# EAGLE design AQS-v4_0 (EAGLE 9.7.0)
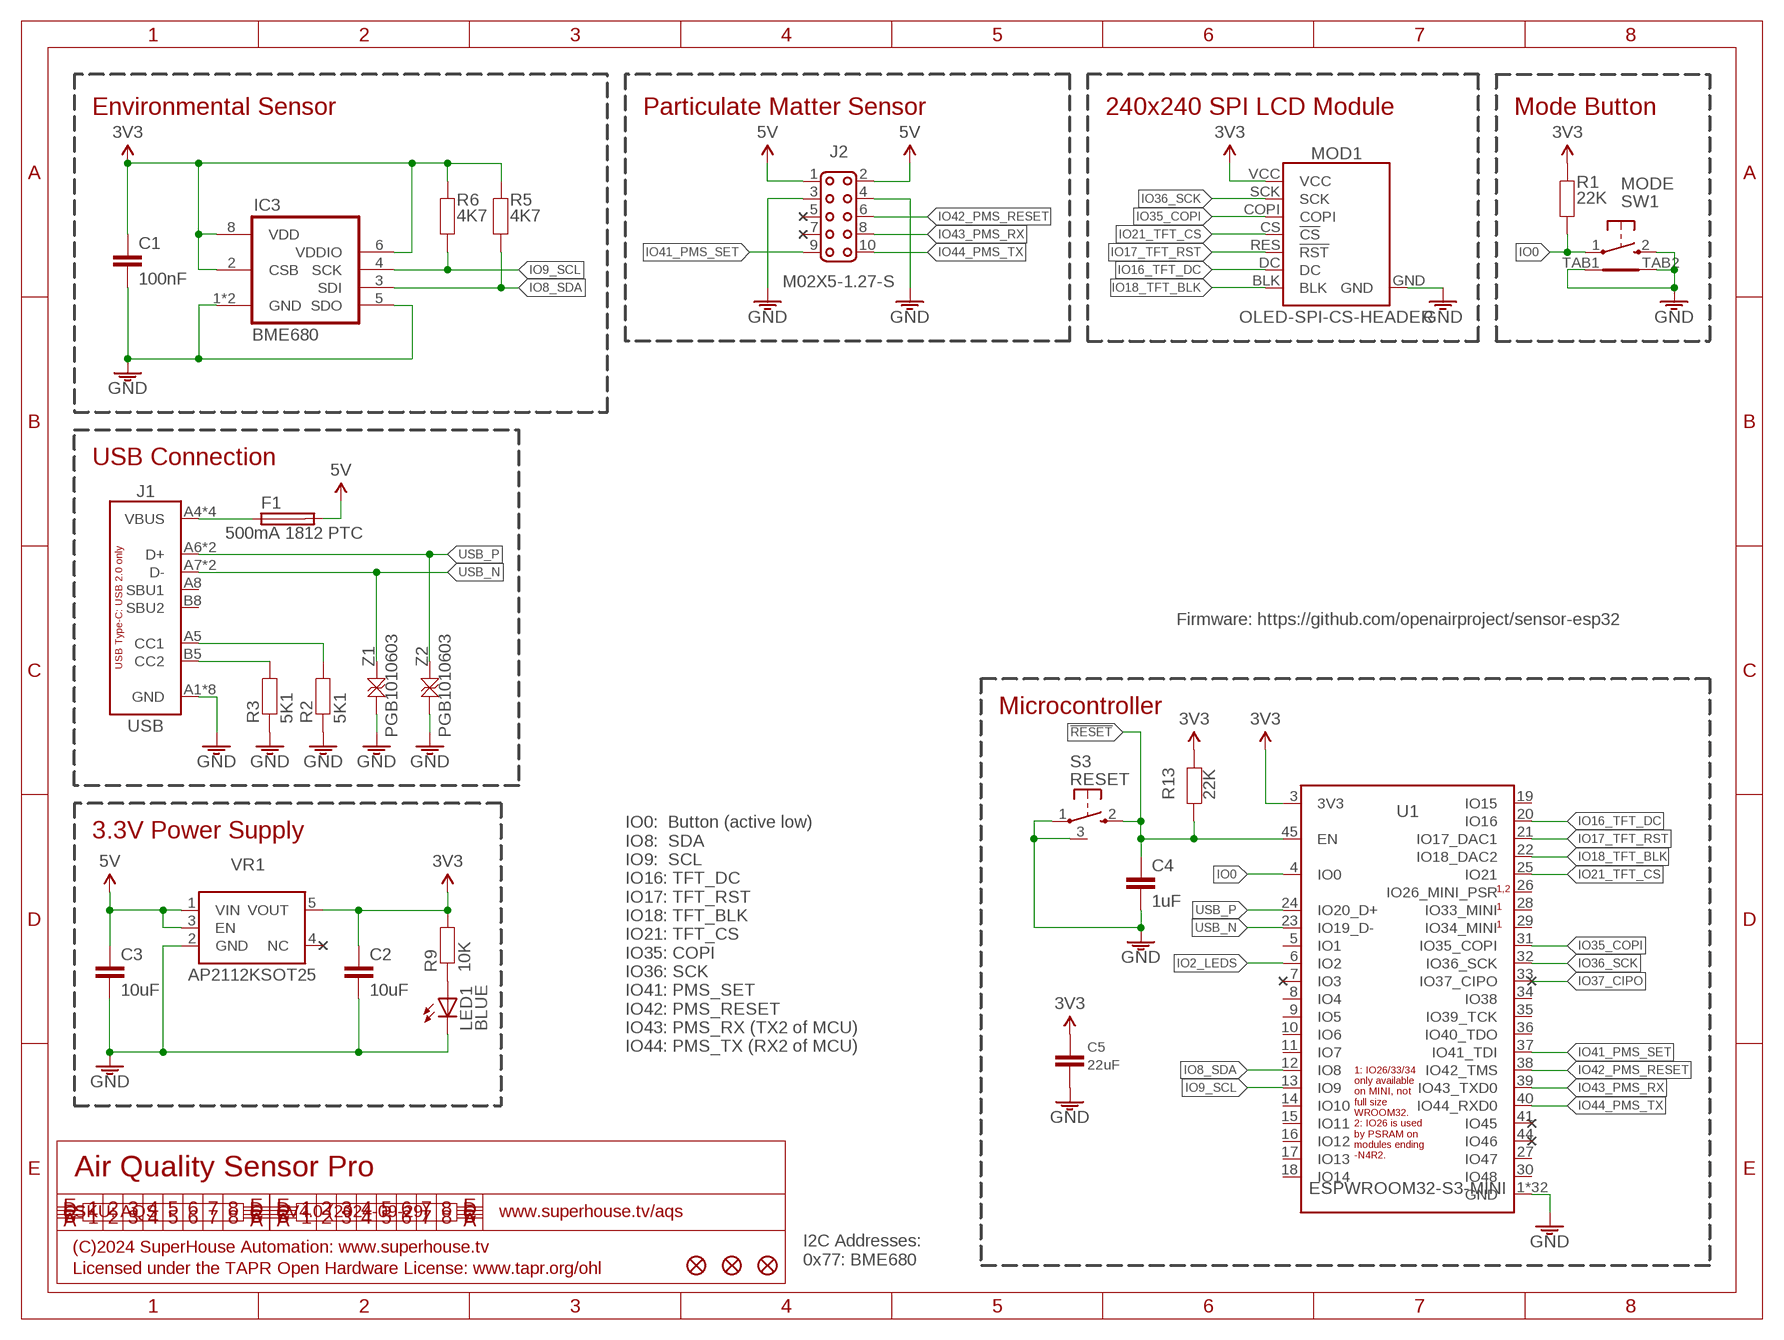
[diagram p0: schematic, sheet 1]

## Parts
C1  100nF  CAP0603  [C0603]
C2  10uF  CAP0805  [C0805]
C3  10uF  CAP0805  [C0805]
C4  1uF  CAP0603  [C0603]
C5  22uF  CAP0805  [C0805]
F1  500mA 1812 PTC  PTC-1206  [1206]
IC3  BME680  [BME680]
J1  USB  USB-C-16P-16P-VERT  [USB-C-VERT]
J2  M02X5-1.27-S  [2X05-1.27-S]
LED1  BLUE  LED0603  [LED-0603]
MOD1  OLED-SPI-CS-HEADER  [OLED-240X240-1.54-HEADER]
R1  22K  RESISTOR0603  [R0603]
R2  5K1  RESISTOR0603  [R0603]
R3  5K1  RESISTOR0603  [R0603]
R5  4K7  RESISTOR0603  [R0603]
R6  4K7  RESISTOR0603  [R0603]
R9  10K  RESISTOR0603  [R0603]
R13  22K  RESISTOR0603  [R0603]
S3  RESET  TAC-SWITCH-1TABGT-TCB73B  [TACT-VERT-1TAB]
SW1  MODE  TAC-SWITCH-2PIN-GND-FSMRAJ  [TYCO-FSMRAJ]
U1  ESPWROOM32-S3-MINI  [ESP32-S3-MINI]
U$23  FIDUCIAL1X2  [FIDUCIAL-1X2]
U$24  FIDUCIAL1X2  [FIDUCIAL-1X2]
U$25  FIDUCIAL1X2  [FIDUCIAL-1X2]
VR1  AP2112KSOT25  [SOT23-5]
Z1  PGB1010603  TVS0603  [TVS0603]
Z2  PGB1010603  TVS0603  [TVS0603]

## Nets
3.3V: C1.1 C2.1 C5.1 IC3.2(CSB) IC3.6(VDDIO) IC3.8(VDD) MOD1.VCC R1.2 R5.2 R6.2 R9.2 R13.1 U1.3(3V3) VR1.5(VOUT)
5V: C3.1 F1.2 J2.1 J2.2 VR1.1(VIN) VR1.3(EN)
!RESET: C4.1 R13.2 S3.2 U1.45(EN)
GND: C1.2 C2.2 C3.2 C4.2 C5.2 IC3.1(GND) IC3.5(SDO) IC3.7(GND) J1.A1(GND) J1.A12(GND) J1.B1(GND) J1.B12(GND) J1.FIX1(GND) J1.FIX2(GND) J1.FIX3(GND) J1.FIX4(GND) J2.3 J2.4 LED1.C MOD1.GND R2.1 R3.1 S3.1 S3.3 SW1.2 SW1.TAB1 SW1.TAB2 U1.1(GND) U1.2(GND) U1.42(GND) U1.43(GND) U1.46(GND) U1.47(GND) U1.48(GND) U1.49(GND) U1.50(GND) U1.51(GND) U1.52(GND) U1.53(GND) U1.54(GND) U1.55(GND) U1.56(GND) U1.57(GND) U1.58(GND) U1.59(GND) U1.60(GND) U1.61(GND) U1.62(GND) U1.63(GND) U1.64(GND) U1.65(GND) U1.G1(GND) U1.G2(GND) U1.G3(GND) U1.G4(GND) U1.G6(GND) U1.G7(GND) U1.G8(GND) U1.G9(GND) VR1.2(GND) Z1.1 Z2.1
IO0: R1.1 SW1.1 U1.4(IO0)
IO2_LEDS: U1.6(IO2)
IO8_SDA: IC3.3(SDI) R5.1 U1.12(IO8)
IO9_SCL: IC3.4(SCK) R6.1 U1.13(IO9)
IO16_TFT_DC: MOD1.DC U1.20(IO16)
IO17_TFT_RST: MOD1.RES(!RST) U1.21(IO17_DAC1)
IO18_TFT_BLK: MOD1.BLK U1.22(IO18_DAC2)
IO21_TFT_CS: MOD1.CS(!CS) U1.25(IO21)
IO35_COPI: MOD1.COPI U1.31(IO35_COPI)
IO36_SCK: MOD1.SCK U1.32(IO36_SCK)
IO37_CIPO: U1.33(IO37_CIPO)
IO41_PMS_SET: J2.9 U1.37(IO41_TDI)
IO42_PMS_RESET: J2.6 U1.38(IO42_TMS)
IO43_PMS_RX: J2.8 U1.39(IO43_TXD0)
IO44_PMS_TX: J2.10 U1.40(IO44_RXD0)
N$1: LED1.A R9.1
N$6: F1.1 J1.A4(VBUS) J1.A9(VBUS) J1.B4(VBUS) J1.B9(VBUS)
N$10: J1.B5(CC2) R3.2
N$11: J1.A5(CC1) R2.2
USB_N: J1.A7(D-) J1.B7(D-) U1.23(IO19_D-) Z1.2
USB_P: J1.A6(D+) J1.B6(D+) U1.24(IO20_D+) Z2.2
Unconnected: J1.A8(SBU1) J1.B8(SBU2) J2.5 J2.7 U1.5(IO1) U1.7(IO3) U1.8(IO4) U1.9(IO5) U1.10(IO6) U1.11(IO7) U1.14(IO10) U1.15(IO11) U1.16(IO12) U1.17(IO13) U1.18(IO14) U1.19(IO15) U1.26(IO26_MINI_PSR) U1.27(IO47) U1.28(IO33_MINI) U1.29(IO34_MINI) U1.30(IO48) U1.34(IO38) U1.35(IO39_TCK) U1.36(IO40_TDO) U1.41(IO45) VR1.4(NC)

## Notes on the sheet
- Environmental Sensor | Particulate Matter Sensor | 240x240 SPI LCD Module | Mode Button
- USB Connection
- Firmware: https://github.com/openairproject/sensor-esp32
- Microcontroller
- 3.3V Power Supply
- IO0:  Button (active low)
  IO8:  SDA
  IO9:  SCL
  IO16: TFT_DC
  IO17: TFT_RST
  IO18: TFT_BLK
  IO21: TFT_CS
  IO35: COPI
  IO36: SCK
  IO41: PMS_SET
  IO42: PMS_RESET
  IO43: PMS_RX (TX2 of MCU)
  IO44: PMS_TX (RX2 of MCU)
- Air Quality Sensor Pro
- SKU: AQS | V4.0 (2024-09-29) | www.superhouse.tv/aqs
- (C)2024 SuperHouse Automation: www.superhouse.tv
- I2C Addresses:
  0x77: BME680
- Licensed under the TAPR Open Hardware License: www.tapr.org/ohl

## Power pins joined to a net without a drawn wire
IO46: U1.44(IO46)

## Library data of the parts
C1-C5 = SuperHouse-DiscreteSemi:CAP: Capacitor Standard ceramic capacitor
F1 = SuperHouse-Fuses:PTC: Resettable polyfuses
IC3 = SuperHouse-Sensors:BME680: BME680 humdity, pressure, temperature, and gas sensor
J1 = SuperHouse-Connectors:USB-C-16P: USB-C socket with 16 pins, suitable only for backward compatibility with USB 2
J2 = SuperHouse-Connectors:M02X5: M10 header in 2x5 format
LED1 = SuperHouse-LEDs:LED: LEDs in various sizes including 5mm and 3mm PTH, and 0402, 0603, 0805, etc SMT
MOD1 = SuperHouse-Displays:OLED-SPI-CS
R1-R3 R5 R6 R9 R13 = SuperHouse-DiscreteSemi:RESISTOR: Resistor Standard resistors.
S3 = SuperHouse-Switches:TAC-SWITCH-1TAB
SW1 = SuperHouse-Switches:TAC-SWITCH-2PIN-GND: Tactile switch (right angle) with 2 mounting tabs
U1 = SuperHouse-MCUs:ESPWROOM32-S3
U$23-U$25 = SuperHouse-Symbols:FIDUCIAL: Fiducial Alignment Points Various fiducial points for machine vision alignment.
VR1 = SuperHouse-Regulators:AP2112K: AP2112K LDO linear voltage regulator
Z1 Z2 = SuperHouse-DiscreteSemi:TVS: TVS voltage protection Zener

## Net classes
0 default: width 0.203 mm, drill 0.356 mm, clearance 0.152 mm
1 power: width 0.203 mm, clearance 0.152 mm

## Board
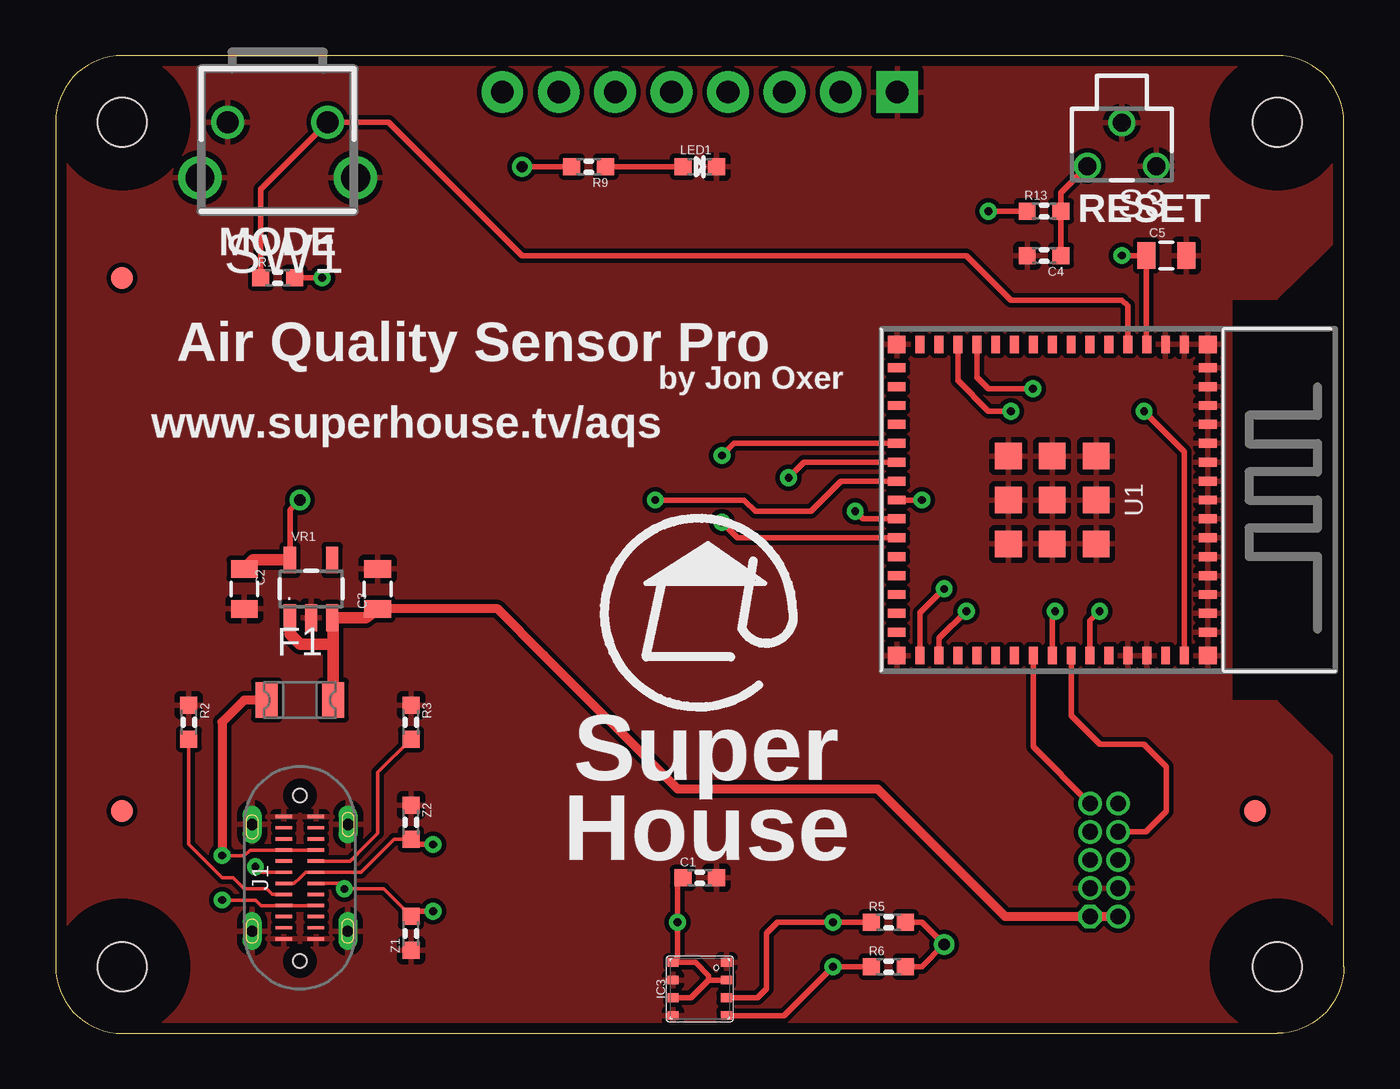
[diagram p1: board, top side]
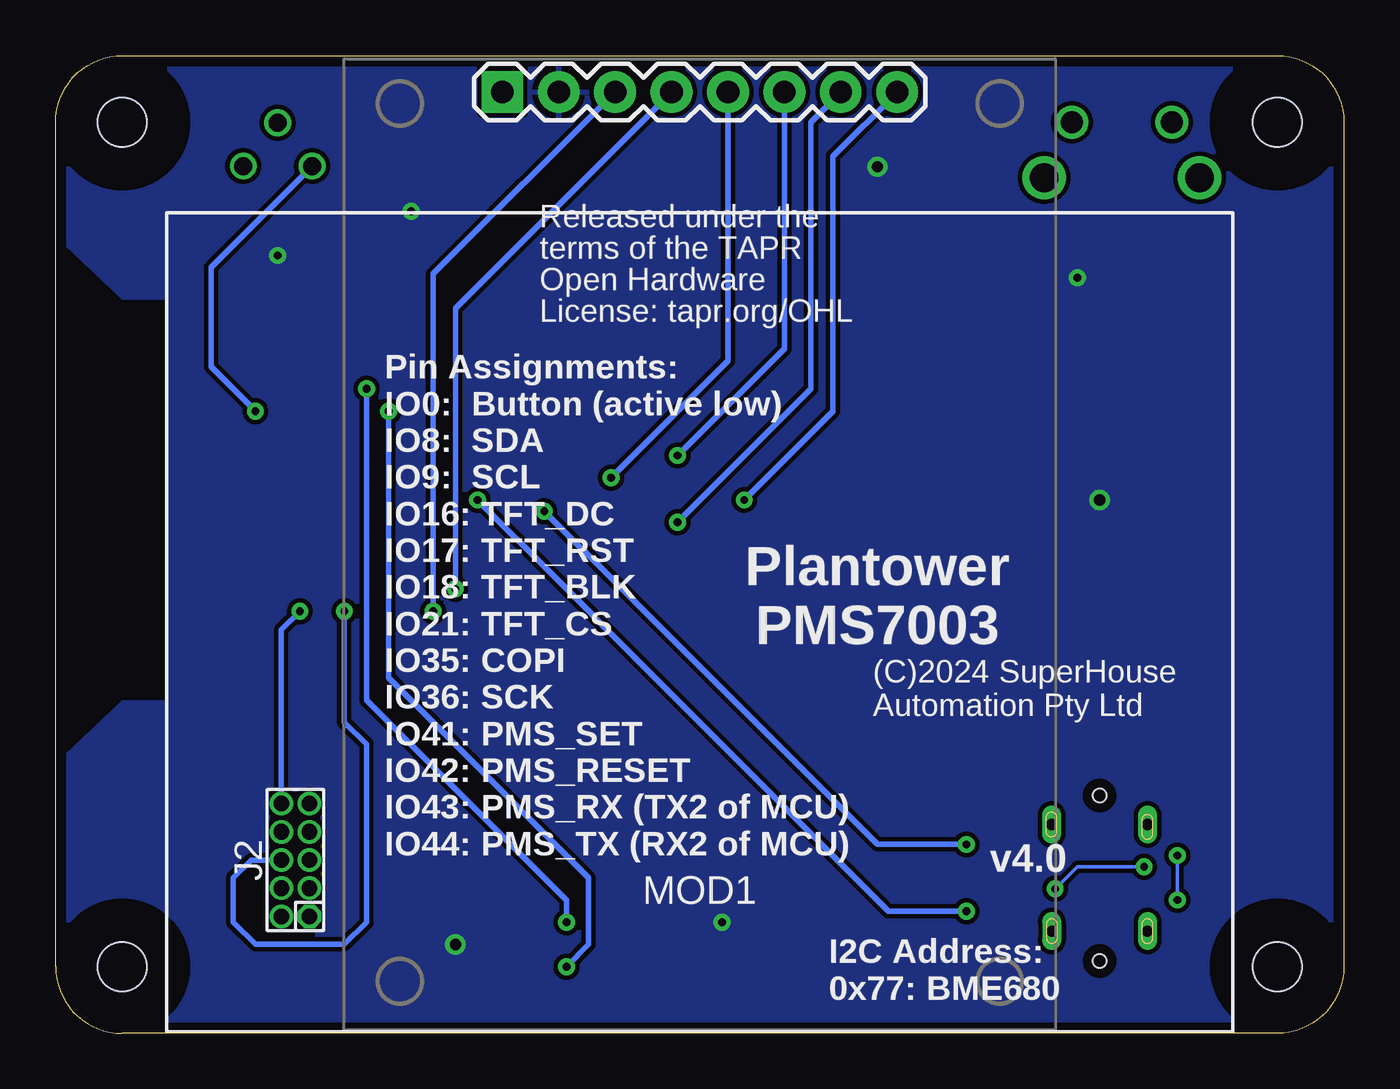
[diagram p2: board, bottom side, seen from below]

Size 58 x 44 mm. Coordinates in mm from the lower left corner, seen from the top.
Outline: 0,41 0,3 arc90 3,0 55,0 arc90 58,3 58,41 arc90 55,44 3,44 arc90 0,41
Copper layers (1*16): Top 0.035mm / dielectric 1.5mm / Bottom 0.035mm
Design rules "SuperHouse-Design-Rules *": minimum track width 10mil, minimum drill 24mil, track to track 8mil, track to pad 8mil, pad to pad 8mil, via to via 8mil, smd to smd 6mil, copper to edge 18mil, drill to drill 8mil, minimum pad ring 7mil, minimum via ring 8mil, stop-mask expansion 4mil, vias tented up to drill 0.5mm, thermal gap 10mil
Holes 2.2 mm at 3,41 55,41 3,3 55,3
tRestrict: area 0,38 to 6,44; area 52,38 to 58,44; area 0,0 to 6,6; area 52,0 to 58,6
bRestrict: area 0,38 to 6,44; area 52,38 to 58,44; area 0,0 to 6,6; area 52,0 to 58,6

### Footprints (pad centres in the part's own frame; a part is rotated, then mirrored left to right if it is on the bottom)
C0603 = smd 0.762 x 0.762: 1 -0.762,0; 2 0.762,0
C0805 = smd 0.8 x 1.2: 1 -0.9,0; 2 0.9,0
1206 = smd 1 x 1.6: 1 -1.5,0; 2 1.5,0
BME680 = smd 0.4 x 0.5: 1 1.2,-1.2; 2 0.4,-1.2; 3 -0.4,-1.2; 4 -1.2,-1.2; 5 -1.2,1.2; 6 -0.4,1.2; 7 0.4,1.2; 8 1.2,1.2
USB-C-VERT = smd 0.15 x 0.75: A1 -2.75,0.725; A2 -2.25,0.725; A3 -1.75,0.725; A4 -1.25,0.725; A5 -0.75,0.725; A6 -0.25,0.725; A7 0.25,0.725; A8 0.75,0.725; A9 1.25,0.725; A10 1.75,0.725; A11 2.25,0.725; A12 2.75,0.725; B1 2.75,-0.725; B2 2.25,-0.725; B3 1.75,-0.725; B4 1.25,-0.725; B5 0.75,-0.725; B6 0.25,-0.725; B7 -0.25,-0.725; B8 -0.75,-0.725; B9 -1.25,-0.725; B10 -1.75,-0.725; B11 -2.25,-0.725; B12 -2.75,-0.725 | drill 0.5 pad 0.7 long: FIX1 -2.4,-2.15; FIX2 -2.4,2.15; FIX3 2.4,2.15; FIX4 2.4,-2.17 | hole 0.6: 3.7,0; -3.75,0
2X05-1.27-S = drill 0.7 pad 1.016 octagon: 1 -2.54,-0.635 | drill 0.7 pad 1.016: 2 -2.54,0.635; 3 -1.27,-0.635; 4 -1.27,0.635; 5 0,-0.635; 6 0,0.635; 7 1.27,-0.635; 8 1.27,0.635; 9 2.54,-0.635; 10 2.54,0.635
LED-0603 = smd 0.762 x 0.762: A -0.762,0; C 0.762,0
OLED-240X240-1.54-HEADER = drill 1.016 pad 1.88: BLK 8.89,20.36; COPI -1.27,20.36; CS 6.35,20.36; DC 3.81,20.36; RES 1.27,20.36; SCK -3.81,20.36; VCC -6.35,20.36 | drill 1.016 pad 1.88 square: GND -8.89,20.36
R0603 = smd 0.762 x 0.762: 1 -0.762,0; 2 0.762,0
TACT-VERT-1TAB = drill 0.8: 1 -1.55,0.975; 2 1.55,0.975; 3 0,-0.975
TYCO-FSMRAJ = drill 1: 1 -2.25,0; 2 2.25,0 | drill 1.3: TAB1 -3.5,2.5; TAB2 3.5,2.5
ESP32-S3-MINI = smd 0.8 x 0.4: 1 -7,5.95; 2 -7,5.1; 3 -7,4.25; 4 -7,3.4; 5 -7,2.55; 6 -7,1.7; 7 -7,0.85; 8 -7,0; 9 -7,-0.85; 10 -7,-1.7; 11 -7,-2.55; 12 -7,-3.4; 13 -7,-4.25; 14 -7,-5.1; 15 -7,-5.95; 31 7,-5.95; 32 7,-5.1; 33 7,-4.25; 34 7,-3.4; 35 7,-2.55; 36 7,-1.7; 37 7,-0.85; 38 7,0; 39 7,0.85; 40 7,1.7; 41 7,2.55; 42 7,3.4; 43 7,4.25; 44 7,5.1; 45 7,5.95 | smd 0.4 x 0.8: 16 -5.95,-7; 17 -5.1,-7; 18 -4.25,-7; 19 -3.4,-7; 20 -2.55,-7; 21 -1.7,-7; 22 -0.85,-7; 23 0,-7; 24 0.85,-7; 25 1.7,-7; 26 2.55,-7; 27 3.4,-7; 28 4.25,-7; 29 5.1,-7; 30 5.95,-7; 46 5.95,7; 47 5.1,7; 48 4.25,7; 49 3.4,7; 50 2.55,7; 51 1.7,7; 52 0.85,7; 53 0,7; 54 -0.85,7; 55 -1.7,7; 56 -2.55,7; 57 -3.4,7; 58 -4.25,7; 59 -5.1,7; 60 -5.95,7 | smd 1.2 x 1.2: 61 0,0; G1 -1.975,1.975; G2 0,1.975; G3 1.975,1.975; G4 -1.975,0; G6 1.975,0; G7 -1.975,-1.975; G8 0,-1.975; G9 1.975,-1.975 | smd 0.8 x 0.8: 62 -7,7; 63 -7,-7; 64 7,-7; 65 7,7
FIDUCIAL-1X2 = smd 1 x 1: 1 0,0
SOT23-5 = smd 0.55 x 1.2: 1 -0.95,-1.3; 2 0,-1.3; 3 0.95,-1.3; 4 0.95,1.3; 5 -0.95,1.3
TVS0603 = smd 0.762 x 0.762: 1 -0.762,0; 2 0.762,0

### Placement (x,y rotation side)
C1  29,7 0 top
C2  8.5,20 270 top
C3  14.5,20 90 top
C4  44.5,35 180 top
C5  50,35 0 top
F1  11,15 0 top
IC3  29,2 90 top
J1  11,7 90 top
J2  47.2,7.8 90 bottom
LED1  29,39 0 top
MOD1  29,22 0 bottom
R1  10,34 0 top
R2  6,14 270 top
R3  16,14 270 top
R5  37.5,5 0 top
R6  37.5,3 0 top
R9  24,39 180 top
R13  44.5,37 0 top
S3  48,40 180 top
SW1  10,41 180 top
U1  44.87,24 270 top
U$23  3,34 0 top
U$24  54,10 0 top
U$25  3,10 0 top
VR1  11.5,20 0 top
Z1  16,4.5 90 top
Z2  16,9.5 270 top

### Tracks (layer width: path | path; a pad name or v marks a point on that pad's centre or on a via)
3.3V  (via drill 0.35, 0.5)
  Top 0.254: IC3.6 28.6,1.6 29.4,2.4 | IC3.2 29.4,2.4 | IC3.8 28.8,3.2 29.4,2.6 29.4,2.4 | R6.2 39,3 v40,4 39,5 R5.2 | v11,24 10.55,23.55 VR1.5 | IC3.8 28,3.4 | v21,39 R9.2 | U1.3 49.1,31.02 C5.1 v48,35 | IC3.8 28,3.4 | 28,3.4 v28,5 28,6.76 C1.1 | R13.1 v42,37 | R1.2 v12,34
  Top 0.508: C2.1 8.9,21.3 VR1.5
  pour Bottom: 58,12 54.95,14.87 52.97,14.87 52.93,14.89 52.89,14.93 52.87,14.97 52.87,33.03 52.89,33.07 52.93,33.11 52.97,33.13 54.95,33.13 58,36 58,41 57.97,41.43 57.88,41.85 57.73,42.25 57.52,42.62 57.27,42.96 56.96,43.27 56.62,43.52 56.25,43.73 55.85,43.88 55.43,43.97 55,44 3,44 2.57,43.97 2.15,43.88 1.75,43.73 1.38,43.52 1.04,43.27 0.73,42.96 0.48,42.62 0.27,42.25 0.12,41.85 0.03,41.43 0,41 0,3 0.03,2.57 0.12,2.15 0.27,1.75 0.48,1.38 0.73,1.04 1.04,0.73 1.38,0.48 1.75,0.27 2.15,0.12 2.57,0.03 3,0 55,0 55.43,0.03 55.85,0.12 56.25,0.27 56.62,0.48 56.96,0.73 57.27,1.04 57.52,1.38 57.73,1.75 57.88,2.15 57.97,2.57 58,3
5V
  Top 0.406: J2.2 J2.1 42.74,5.26 37.9,10.1 37,11 31,11 28,11 22,17 19.9,19.1 C3.1
  Top 0.508: 12.5,17.5 12.5,18.65 VR1.3 13.96,18.7 C3.1 | 12.5,17.5 12,17.5 11,17.5 10.55,17.95 VR1.1 | F1.2 12.5,17.5
!RESET  (via drill 0.35)
  Top 0.254: C4.1 R13.2 45.26,37.84 S3.2 | U1.45 50.82,26.18 v49,28
  Bottom 0.254: v49,28 51,30 51,32 51,34.48 S3.2
GND
  pour Top: 58,12 54.98,14.95 52.98,14.95 52.95,14.98 52.95,33.02 52.98,33.05 54.98,33.05 58,36 58,41 57.97,41.43 57.88,41.85 57.73,42.25 57.52,42.62 57.27,42.96 56.96,43.27 56.62,43.52 56.25,43.73 55.85,43.88 55.43,43.97 55,44 3,44 2.57,43.97 2.15,43.88 1.75,43.73 1.38,43.52 1.04,43.27 0.73,42.96 0.48,42.62 0.27,42.25 0.12,41.85 0.03,41.43 0,41 0,3 0.03,2.57 0.12,2.15 0.27,1.75 0.48,1.38 0.73,1.04 1.04,0.73 1.38,0.48 1.75,0.27 2.15,0.12 2.57,0.03 3,0 55,0 55.43,0.03 55.85,0.12 56.25,0.27 56.62,0.48 56.96,0.73 57.27,1.04 57.52,1.38 57.73,1.75 57.88,2.15 57.97,2.57 58,3
IO0
  Top 0.254: R1.1 9.24,37.99 SW1.1 15,41 17,39 21,35 41,35 43,33 44,33 48,33 48.27,32.73 U1.4
IO8_SDA  (via drill 0.35)
  Top 0.254: IC3.3 31.6,1.6 32,2 32,4.5 32.5,5 v35,5 R5.1 | U1.12 41.47,29.53 42,29 v44,29
  Bottom 0.254: v44,29 44,19 44,16 44,15 39,10 35,6 v35,5
IO9_SCL  (via drill 0.35)
  Top 0.254: IC3.4 32.8,0.8 33.74,1.74 v35,3 R6.1 | U1.13 40.62,29.38 42,28 v43,28
  Bottom 0.254: v43,28 43,25 43,16 41,14 34,7 34,6 34,4 v35,3
IO16_TFT_DC  (via drill 0.35)
  Top 0.254: v30,26 30.55,26.55 U1.20
  Bottom 0.254: MOD1.DC 25.19,30.81 v30,26
IO17_TFT_RST  (via drill 0.35)
  Top 0.254: v33,25 33.7,25.7 U1.21
  Bottom 0.254: MOD1.RES 27.73,30.27 v33,25
IO18_TFT_BLK  (via drill 0.35)
  Top 0.254: v27,24 31,24 31.5,23.5 32.5,23.5 34,23.5 34.5,24 35.35,24.85 U1.22
  Bottom 0.254: MOD1.BLK 23,39.47 23,38 23,28 v27,24
IO21_TFT_CS  (via drill 0.35)
  Top 0.254: v30,23 30.7,22.3 U1.25
  Bottom 0.254: MOD1.CS 24,41.01 24,30 24,29 v30,23
IO35_COPI  (via drill 0.35)
  Top 0.254: U1.31 38.92,18.92 v40,20
  Bottom 0.254: v40,20 40,32.63 MOD1.COPI
IO36_SCK  (via drill 0.35)
  Top 0.254: U1.32 39.77,17.77 v41,19
  Bottom 0.254: v41,19 41,34 41,34.17 MOD1.SCK
IO41_PMS_SET
  Top 0.254: U1.37 44.02,12.88 J2.9
IO42_PMS_RESET  (via drill 0.35)
  Top 0.254: U1.38 44.87,18.87 v45,19
  Bottom 0.254: v45,19 45,14 44,13 44,5 45,4 49,4 50,5 50,7 49.2,7.8 J2.6
IO43_PMS_RX
  Top 0.254: U1.39 45.72,14.28 47,13 49,13 50,12 50,10 49.07,9.07 J2.8
IO44_PMS_TX  (via drill 0.35)
  Top 0.254: v47,19 46.57,18.57 U1.40
  Bottom 0.254: J2.10 47.84,18.16 v47,19
N$1
  Top 0.254: R9.1 LED1.A
N$6  (via drill 0.35)
  Top 0.152: J1.B4 J1.A9 8.75,8.25 8.5,8 v7.5,8 | J1.B9 J1.A4 9.25,5.75 9,6 v7.5,6
  Top 0.406: F1.1 8.5,15 7.5,14 v7.5,8
  Bottom 0.152: v7.5,6 v7.5,8
N$10
  Top 0.152: J1.B5 13.25,7.75 14,8.5 14.5,9 14.5,10 14.5,11.74 R3.2
N$11
  Top 0.152: J1.A5 9.75,6.25 9.5,6.5 9,6.5 8.5,6.5 8,7 7.5,7 6,8.5 R2.2
USB_N  (via drill 0.35)
  Top 0.152: J1.A7 9.25,7.25 v9,7.5 | J1.B7 12.75,6.75 v13,6.5 14.76,6.5 Z1.2
  Top 0.254: U1.23 v39,24 | v17,5.5 16.24,5.5 Z1.2
  Bottom 0.152: v9,7.5 12,7.5 v13,6.5
  Bottom 0.254: v39,24 35.5,20.5 32,17 20.5,5.5 v17,5.5
USB_P  (via drill 0.35)
  Top 0.152: J1.A6 10.75,6.75 11,7 11.25,7.25 J1.B6 13.75,7.25 14,7.5 15.24,8.74 Z2.2
  Top 0.254: U1.24 36.35,23.15 v36,23.5 | v17,8.5 16.24,8.5 Z2.2
  Bottom 0.254: v36,23.5 32.5,20 21,8.5 v17,8.5

### Text on the board
tPlace: RESET | MODE | Air Quality Sensor Pro | by Jon Oxer | www.superhouse.tv/aqs | Super / House
bPlace: Released under the / terms of the TAPR / Open Hardware / License: tapr.org/OHL | Plantower / PMS7003 | (C)2024 SuperHouse / Automation Pty Ltd | Pin Assignments: / IO0: Button (active low) / IO8: SDA / IO9: SCL / IO16: TFT_DC / IO17: TFT_RST / IO18: TFT_BLK / IO21: TFT_CS / IO35: COPI / IO36: SCK / IO41: PMS_SET / IO42: PMS_RESET / IO43: PMS_RX (TX2 of MCU) / IO44: PMS_TX (RX2 of MCU) | v4.0 | I2C Address: / 0x77: BME680